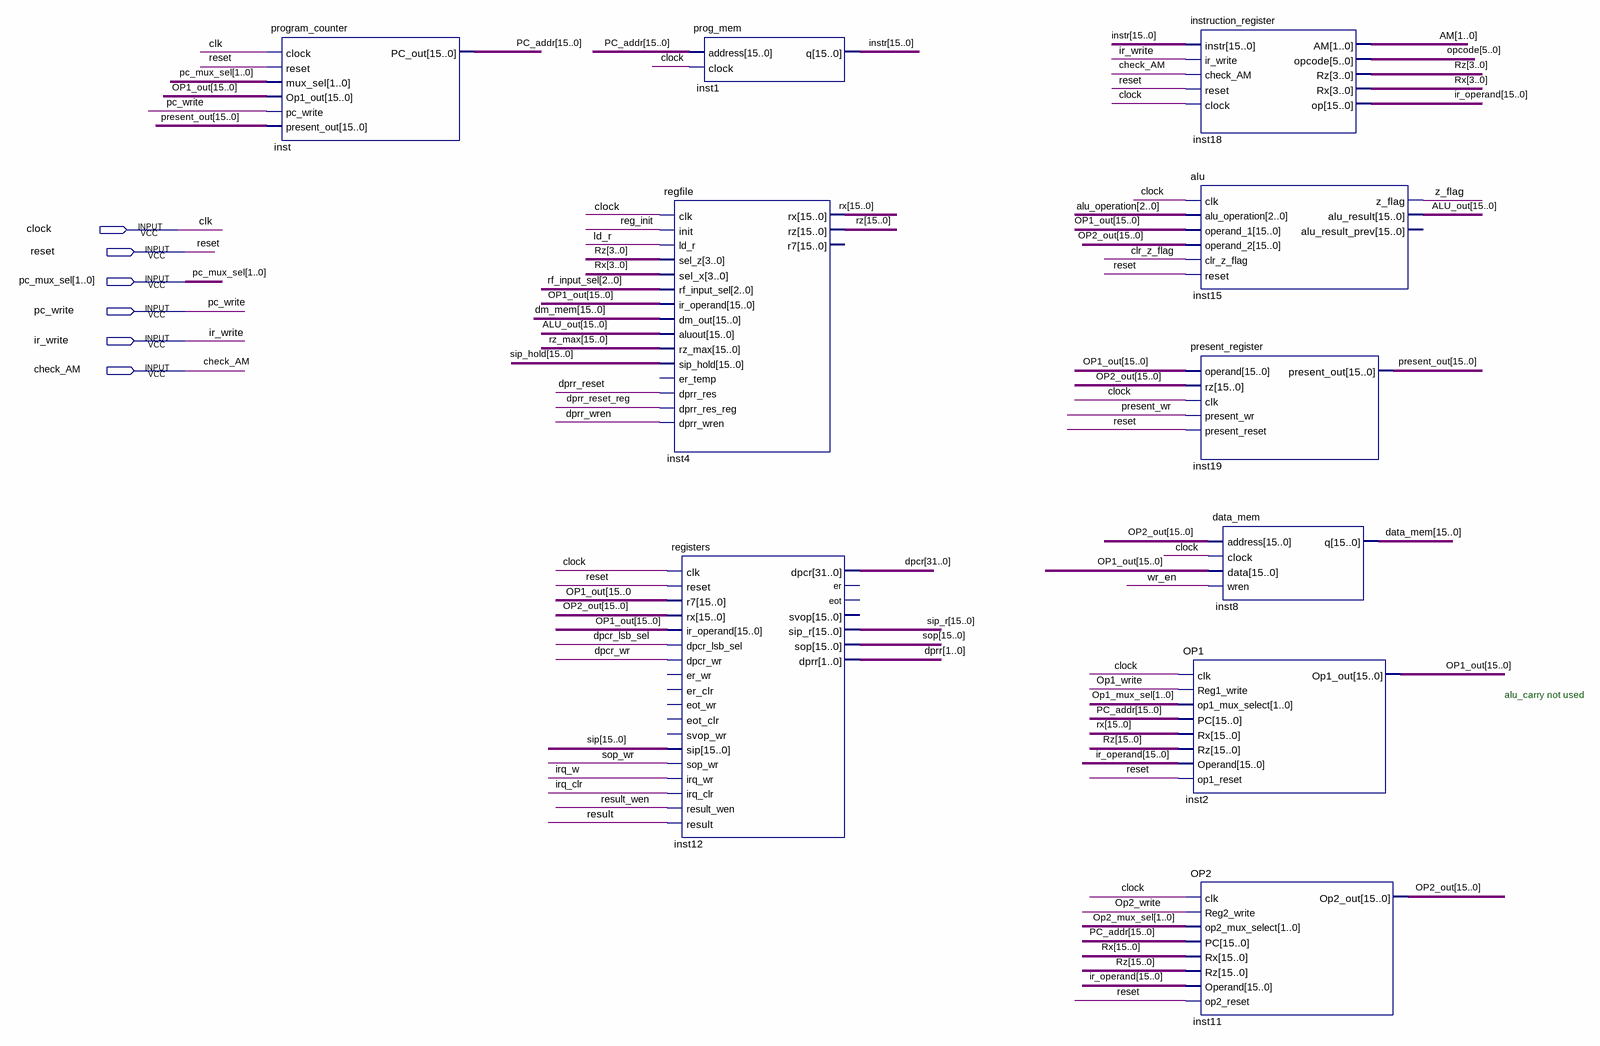
[diagram p0: schematic sheet]
// Quartus schematic ReCOP.bdf as structural Verilog: 10 symbols, 6 pins
module ReCOP (
  input  clock,
  input  reset,
  input  [1:0] pc_mux_sel,
  input  pc_write,
  input  ir_write,
  input  check_AM
);

  wire clr_z_flag, dpcr_lsb_sel, dpcr_wr, dprr_reset, dprr_reset_reg, dprr_wren, irq_clr, irq_w, ld_r,
       \OP1_out[15..0 , Op1_write, Op2_write, present_wr, reg_init, result, result_wen, sop_wr, wr_en, z_flag;
  wire [1:0] AM, dprr, Op1_mux_sel, Op2_mux_sel;
  wire [2:0] alu_operation, rf_input_sel;
  wire [5:0] opcode;
  wire [15:0] ALU_out, data_mem, dm_mem, instr, ir_operand, OP1_out, OP2_out, PC_addr, present_out, Rx, Rz,
       rz_max, sip, sip_hold, sip_r, sop;
  wire [31:0] dpcr;

  program_counter inst (
    .clock(clock), .reset(reset), .mux_sel(pc_mux_sel), .Op1_out(OP1_out), .pc_write(pc_write),
    .present_out(present_out), .PC_out(PC_addr));
  prog_mem inst1 (.address(PC_addr), .clock(clock), .q(instr));
  regfile inst4 (
    .clk(clock), .init(reg_init), .ld_r(ld_r), .sel_z(Rz[3:0]), .sel_x(Rx[3:0]), .rf_input_sel(rf_input_sel),
    .ir_operand(OP1_out), .dm_out(dm_mem), .aluout(ALU_out), .rz_max(rz_max), .sip_hold(sip_hold),
    .dprr_res(dprr_reset), .dprr_res_reg(dprr_reset_reg), .dprr_wren(dprr_wren), .rx(Rx), .rz(Rz));  // open: er_temp, r7
  registers inst12 (
    .clk(clock), .reset(reset), .r7({16{\OP1_out[15..0 }}), .rx(OP2_out), .ir_operand(OP1_out),
    .dpcr_lsb_sel(dpcr_lsb_sel), .dpcr_wr(dpcr_wr), .sip(sip), .sop_wr(sop_wr), .irq_wr(irq_w),
    .irq_clr(irq_clr), .result_wen(result_wen), .result(result), .dpcr(dpcr), .sip_r(sip_r), .sop(sop),
    .dprr(dprr));  // open: er_wr, er_clr, eot_wr, eot_clr, svop_wr, er, eot, svop
  OP1 inst2 (
    .clk(clock), .Reg1_write(Op1_write), .op1_mux_select(Op1_mux_sel), .PC(PC_addr), .Rx(Rx), .Rz(Rz),
    .Operand(ir_operand), .op1_reset(reset), .Op1_out(OP1_out));
  instruction_register inst18 (
    .instr(instr), .ir_write(ir_write), .check_AM(check_AM), .reset(reset), .clock(clock), .AM(AM),
    .opcode(opcode), .Rz(Rz[3:0]), .Rx(Rx[3:0]), .op(ir_operand));
  alu inst15 (
    .clk(clock), .alu_operation(alu_operation), .operand_1(OP1_out), .operand_2(OP2_out),
    .clr_z_flag(clr_z_flag), .reset(reset), .z_flag(z_flag), .alu_result(ALU_out));  // open: alu_result_prev
  present_register inst19 (
    .operand(OP1_out), .rz(OP2_out), .clk(clock), .present_wr(present_wr), .present_reset(reset),
    .present_out(present_out));
  data_mem inst8 (.address(OP2_out), .clock(clock), .data(OP1_out), .wren(wr_en), .q(data_mem));
  OP2 inst11 (
    .clk(clock), .Reg2_write(Op2_write), .op2_mux_select(Op2_mux_sel), .PC(PC_addr), .Rx(Rx), .Rz(Rz),
    .Operand(ir_operand), .op2_reset(reset), .Op2_out(OP2_out));

  // Other names for the same wires on the sheet: clk = clock

  // Notes on the sheet:
  //   alu_carry not used
endmodule
